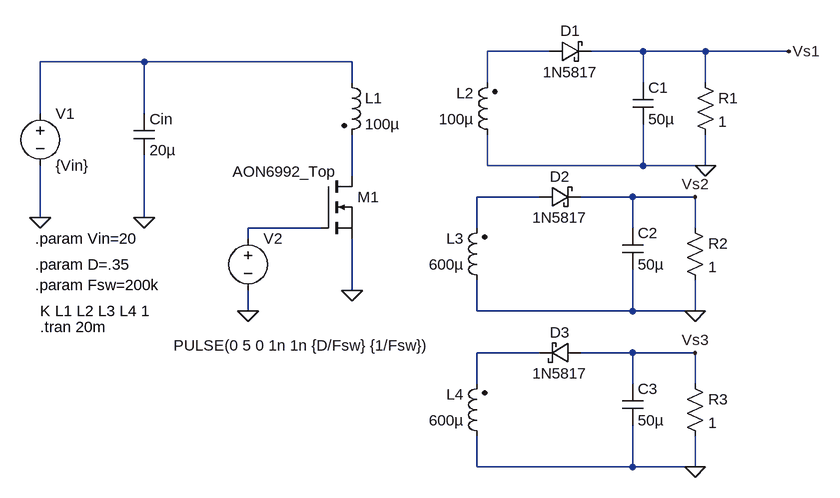
[diagram p0: schematic simpleFlyBack.asc]
simpleFlyBack.asc, the LTspice schematic file:
Version 4
SHEET 1 1100 708
WIRE 672 32 576 32
WIRE 816 32 736 32
WIRE 912 32 816 32
WIRE 1040 32 912 32
WIRE 48 48 -112 48
WIRE 368 48 48 48
WIRE 368 80 368 48
WIRE 576 80 576 32
WIRE 816 80 816 32
WIRE 912 80 912 32
WIRE -112 128 -112 48
WIRE 48 128 48 48
WIRE 576 208 576 160
WIRE 816 208 816 144
WIRE 816 208 576 208
WIRE 912 208 912 160
WIRE 912 208 816 208
WIRE 368 224 368 160
WIRE 656 256 560 256
WIRE 800 256 720 256
WIRE 896 256 800 256
WIRE -112 288 -112 208
WIRE 48 288 48 192
WIRE 320 304 208 304
WIRE 560 304 560 256
WIRE 800 304 800 256
WIRE 896 304 896 256
WIRE 208 320 208 304
WIRE 368 400 368 320
WIRE 208 432 208 400
WIRE 560 432 560 384
WIRE 800 432 800 368
WIRE 800 432 560 432
WIRE 896 432 896 384
WIRE 896 432 800 432
WIRE 656 496 560 496
WIRE 800 496 720 496
WIRE 896 496 800 496
WIRE 560 544 560 496
WIRE 800 544 800 496
WIRE 896 544 896 496
WIRE 560 672 560 624
WIRE 800 672 800 608
WIRE 800 672 560 672
WIRE 896 672 896 624
WIRE 896 672 800 672
FLAG -112 288 0
FLAG 48 288 0
FLAG 368 400 0
FLAG 208 432 0
FLAG 912 208 0
FLAG 896 432 0
FLAG 896 672 0
FLAG 1040 32 Vs1
FLAG 896 256 Vs2
FLAG 896 496 Vs3
SYMBOL voltage -112 112 R0
WINDOW 123 0 0 Left 0
WINDOW 39 0 0 Left 0
SYMATTR InstName V1
SYMATTR Value {Vin}
SYMBOL cap 32 128 R0
SYMATTR InstName Cin
SYMATTR Value 20µ
SYMBOL ind2 352 64 R0
SYMATTR InstName L1
SYMATTR Value 100µ
SYMATTR Type ind
SYMBOL nmos 320 224 R0
WINDOW 3 -136 -7 Left 2
SYMATTR InstName M1
SYMATTR Value AON6992_Top
SYMBOL voltage 208 304 R0
WINDOW 3 -115 181 Left 2
WINDOW 123 0 0 Left 0
WINDOW 39 0 0 Left 0
SYMATTR InstName V2
SYMATTR Value PULSE(0 5 0 1n 1n {D/Fsw} {1/Fsw})
SYMBOL ind2 592 176 R180
WINDOW 0 36 80 Left 2
WINDOW 3 36 40 Left 2
SYMATTR InstName L2
SYMATTR Value 100µ
SYMATTR Type ind
SYMBOL schottky 672 48 R270
WINDOW 0 32 32 VTop 2
WINDOW 3 0 32 VBottom 2
SYMATTR InstName D1
SYMATTR Value 1N5817
SYMATTR Description Diode
SYMATTR Type diode
SYMBOL cap 800 80 R0
SYMATTR InstName C1
SYMATTR Value 50µ
SYMATTR SpiceLine Rser=0
SYMBOL res 896 64 R0
SYMATTR InstName R1
SYMATTR Value 1
SYMBOL ind2 576 400 R180
WINDOW 0 36 80 Left 2
WINDOW 3 36 40 Left 2
SYMATTR InstName L3
SYMATTR Value 600µ
SYMATTR Type ind
SYMBOL schottky 656 272 R270
WINDOW 0 32 32 VTop 2
WINDOW 3 0 32 VBottom 2
SYMATTR InstName D2
SYMATTR Value 1N5817
SYMATTR Description Diode
SYMATTR Type diode
SYMBOL cap 784 304 R0
SYMATTR InstName C2
SYMATTR Value 50µ
SYMBOL res 880 288 R0
SYMATTR InstName R2
SYMATTR Value 1
SYMBOL ind2 576 640 R180
WINDOW 0 36 80 Left 2
WINDOW 3 36 40 Left 2
SYMATTR InstName L4
SYMATTR Value 600µ
SYMATTR Type ind
SYMBOL schottky 720 480 R90
WINDOW 0 0 32 VBottom 2
WINDOW 3 32 32 VTop 2
SYMATTR InstName D3
SYMATTR Value 1N5817
SYMATTR Description Diode
SYMATTR Type diode
SYMBOL cap 784 544 R0
SYMATTR InstName C3
SYMATTR Value 50µ
SYMBOL res 880 528 R0
SYMATTR InstName R3
SYMATTR Value 1
TEXT -120 320 Left 2 !.param Vin=20
TEXT -120 360 Left 2 !.param D=.35
TEXT -120 392 Left 2 !.param Fsw=200k
TEXT -112 432 Left 2 !K L1 L2 L3 L4 1
TEXT -112 456 Left 2 !.tran 20m

The netlist it stands for:
* simpleFlyBack.asc
V1 N002 0 {Vin}
Cin N002 0 20µ
L1 N002 N003 100µ
M1 N003 N005 0 0 AON6992_Top
V2 N005 0 PULSE(0 5 0 1n 1n {D/Fsw} {1/Fsw})
L2 0 N001 100µ
D1 N001 Vs1 1N5817
C1 Vs1 0 50µ Rser=0
R1 Vs1 0 1
L3 0 N004 600µ
D2 N004 Vs2 1N5817
C2 Vs2 0 50µ
R2 Vs2 0 1
L4 0 N006 600µ
D3 Vs3 N006 1N5817
C3 Vs3 0 50µ
R3 Vs3 0 1
.model D D
.lib standard.dio
.model NMOS NMOS
.model PMOS PMOS
.lib standard.mos
.param Vin=20
.param D=.35
.param Fsw=200k
K L1 L2 L3 L4 1
.tran 20m
.backanno
.end